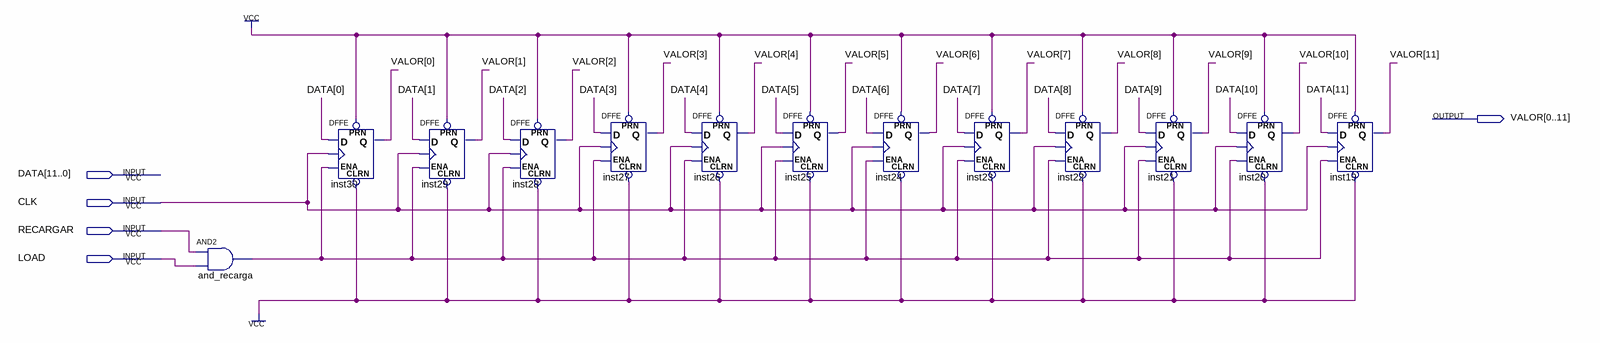
[diagram p0: schematic sheet]
// Quartus schematic Registro_carga.bdf as structural Verilog: 13 symbols, 5 pins
module Registro_carga (
  input  [11:0] DATA,
  input  CLK,
  input  RECARGAR,
  input  LOAD,
  output [0:11] VALOR
);

  wire and_recarga_out;

  and and_recarga (and_recarga_out, RECARGAR, LOAD);
  DFFE inst30 (.PRN(1'b1), .CLRN(1'b1), .D(DATA[0]), .CLK(CLK), .ENA(and_recarga_out), .Q(VALOR[0]));
  DFFE inst29 (.PRN(1'b1), .CLRN(1'b1), .D(DATA[1]), .CLK(CLK), .ENA(and_recarga_out), .Q(VALOR[1]));
  DFFE inst28 (.PRN(1'b1), .CLRN(1'b1), .D(DATA[2]), .CLK(CLK), .ENA(and_recarga_out), .Q(VALOR[2]));
  DFFE inst27 (.PRN(1'b1), .CLRN(1'b1), .D(DATA[3]), .CLK(CLK), .ENA(and_recarga_out), .Q(VALOR[3]));
  DFFE inst26 (.PRN(1'b1), .CLRN(1'b1), .D(DATA[4]), .CLK(CLK), .ENA(and_recarga_out), .Q(VALOR[4]));
  DFFE inst25 (.PRN(1'b1), .CLRN(1'b1), .D(DATA[5]), .CLK(CLK), .ENA(and_recarga_out), .Q(VALOR[5]));
  DFFE inst24 (.PRN(1'b1), .CLRN(1'b1), .D(DATA[6]), .CLK(CLK), .ENA(and_recarga_out), .Q(VALOR[6]));
  DFFE inst23 (.PRN(1'b1), .CLRN(1'b1), .D(DATA[7]), .CLK(CLK), .ENA(and_recarga_out), .Q(VALOR[7]));
  DFFE inst22 (.PRN(1'b1), .CLRN(1'b1), .D(DATA[8]), .CLK(CLK), .ENA(and_recarga_out), .Q(VALOR[8]));
  DFFE inst21 (.PRN(1'b1), .CLRN(1'b1), .D(DATA[9]), .CLK(CLK), .ENA(and_recarga_out), .Q(VALOR[9]));
  DFFE inst20 (.PRN(1'b1), .CLRN(1'b1), .D(DATA[10]), .CLK(CLK), .ENA(and_recarga_out), .Q(VALOR[10]));
  DFFE inst19 (.PRN(1'b1), .CLRN(1'b1), .D(DATA[11]), .CLK(CLK), .ENA(and_recarga_out), .Q(VALOR[11]));
endmodule
